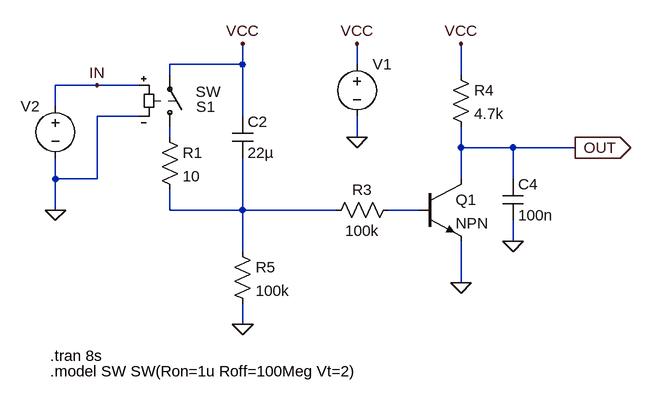
[diagram p0: schematic v2.0.asc]
v2.0.asc, the LTspice schematic file:
Version 4.1
SHEET 1 1772 996
WIRE 416 320 416 288
WIRE 416 320 304 320
WIRE 592 320 592 288
WIRE 304 336 304 320
WIRE 752 336 752 288
WIRE 192 352 128 352
WIRE 256 352 192 352
WIRE 128 384 128 352
WIRE 256 400 192 400
WIRE 416 400 416 320
WIRE 304 432 304 416
WIRE 592 432 592 400
WIRE 752 448 752 416
WIRE 832 448 752 448
WIRE 928 448 832 448
WIRE 128 496 128 464
WIRE 192 496 192 400
WIRE 192 496 128 496
WIRE 752 496 752 448
WIRE 832 496 832 448
WIRE 128 544 128 496
WIRE 304 544 304 512
WIRE 416 544 416 464
WIRE 416 544 304 544
WIRE 560 544 416 544
WIRE 688 544 640 544
WIRE 832 592 832 560
WIRE 416 608 416 544
WIRE 752 656 752 592
WIRE 416 720 416 688
FLAG 592 432 0
FLAG 928 448 OUT
IOPIN 928 448 Out
FLAG 192 352 IN
FLAG 128 544 0
FLAG 592 288 VCC
FLAG 416 288 VCC
FLAG 752 656 0
FLAG 752 288 VCC
FLAG 416 720 0
FLAG 832 592 0
SYMBOL sw 304 432 M180
WINDOW 0 41 47 Left 2
WINDOW 3 40 70 Left 2
SYMATTR InstName S1
SYMBOL res 288 416 R0
SYMATTR InstName R1
SYMATTR Value 10
SYMBOL voltage 592 304 R0
WINDOW 123 0 0 Left 0
WINDOW 39 0 0 Left 0
WINDOW 3 41 64 Invisible 2
SYMATTR Value PULSE(0 3.3 0.5 1n 1n 8 8 1)
SYMATTR InstName V1
SYMBOL voltage 128 368 M0
WINDOW 3 41 64 Invisible 2
WINDOW 123 0 0 Left 0
WINDOW 39 39 69 Left 2
SYMATTR Value PULSE(0 3.3 4 1n 1n 50m 80m 1)
SYMATTR InstName V2
SYMBOL res 656 528 R90
WINDOW 0 0 56 VBottom 2
WINDOW 3 32 56 VTop 2
SYMATTR InstName R3
SYMATTR Value 100k
SYMBOL npn 688 496 R0
SYMATTR InstName Q1
SYMBOL res 736 320 R0
SYMATTR InstName R4
SYMATTR Value 4.7k
SYMBOL res 400 592 R0
SYMATTR InstName R5
SYMATTR Value 100k
SYMBOL cap 400 400 R0
SYMATTR InstName C2
SYMATTR Value 22µ
SYMATTR SpiceLine Rser=0.05
SYMBOL cap 816 496 R0
SYMATTR InstName C4
SYMATTR Value 100n
TEXT 120 768 Left 2 !.tran 8s
TEXT 120 792 Left 2 !.model SW SW(Ron=1u Roff=100Meg Vt=2)

The netlist it stands for:
* v2.0.asc
S1 N001 VCC IN 0 SW
R1 N001 N002 10
V1 VCC 0 PULSE(0 3.3 0.5 1n 1n 8 8 1)
V2 IN 0 PULSE(0 3.3 4 1n 1n 50m 80m 1)
R3 N003 N002 100k
Q1 OUT N003 0 0 NPN
R4 VCC OUT 4.7k
R5 N002 0 100k
C2 VCC N002 22µ Rser=0.05
C4 OUT 0 100n
.model NPN NPN
.model PNP PNP
.lib standard.bjt
.tran 8s
.model SW SW(Ron=1u Roff=100Meg Vt=2)
.backanno
.end